# EAGLE design rf-sender-v1 (EAGLE 6.4)
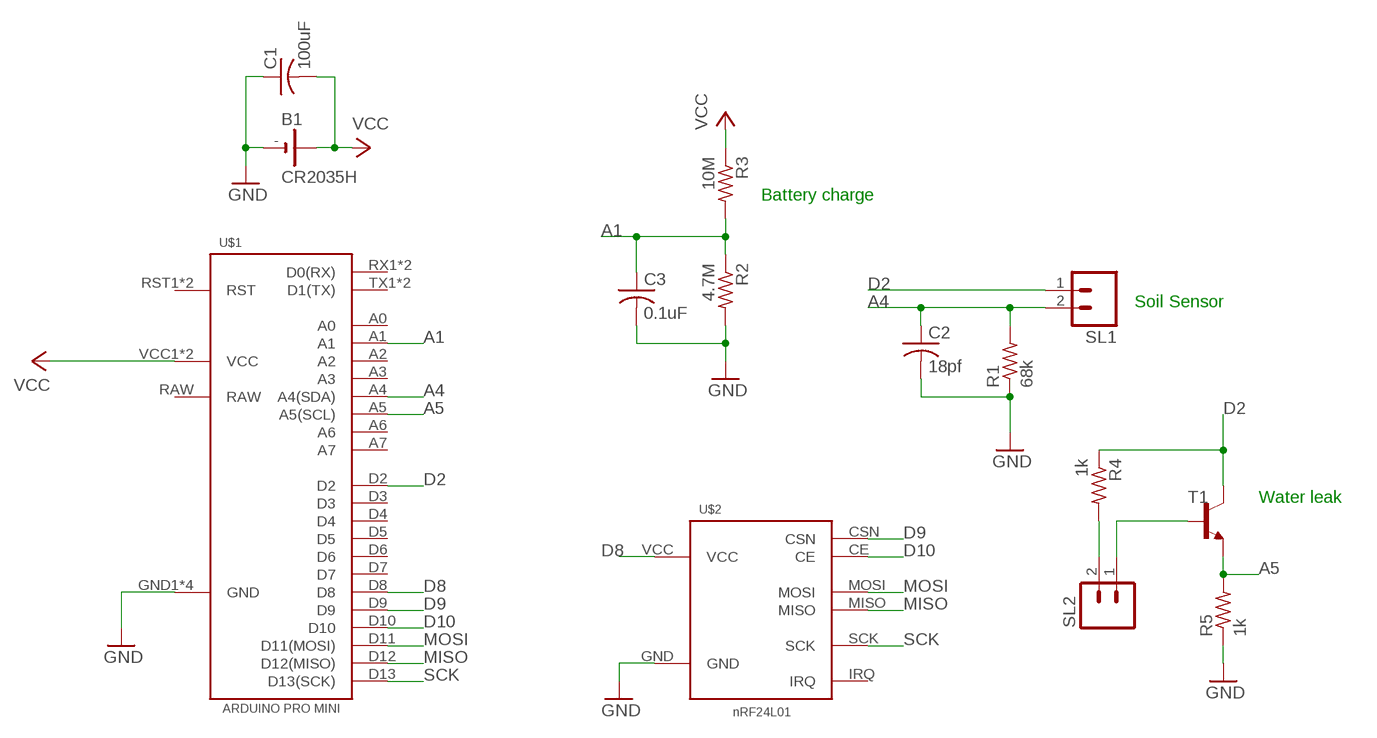
[diagram p0: schematic, sheet 1]

## Parts
B1  CR2035H  [CR2032H]
C1  100uF  C-USC2220K  [C2220K]
C2  18pf  C-USC0805  [C0805]
C3  0.1uF  C-USC0603  [C0603]
R1  68k  R-US_R0603  [R0603]
R2  4.7M  R-US_R0603  [R0603]
R3  10M  R-US_R0603  [R0603]
R4  1k  R-US_R0603  [R0603]
R5  1k  R-US_R0603  [R0603]
SL1  M02  [02P]
SL2  M02  [02P]
T1  BC808-NPN-SOT23-BEC  [SOT23-BEC]
U$1  ARDUINO-PRO-MINI  [ARDUINO-PRO-MINI]
U$2  NRF24L01MODULE  [NRF24L01-MODULE]

## Nets
A1: C3.1 R2.1 R3.2 U$1.A1
A4: C2.1 R1.2 SL1.2 U$1.A4(A4(SDA))
A5: R5.2 T1.E U$1.A5(A5(SCL))
D2: R4.1 SL1.1 T1.C U$1.D2
D8: U$1.D8 U$2.VCC
D9: U$1.D9 U$2.CSN
D10: U$1.D10 U$2.CE
GND: B1.- C1.1 C2.2 C3.2 R1.1 R2.2 R5.1 U$1.GND1(GND) U$1.GND2(GND) U$1.GND3(GND) U$1.GND4(GND) U$2.GND
MISO: U$1.D12(D12(MISO)) U$2.MISO
MOSI: U$1.D11(D11(MOSI)) U$2.MOSI
N$3: SL2.1 T1.B
N$4: R4.2 SL2.2
SCK: U$1.D13(D13(SCK)) U$2.SCK
VCC: B1.+ C1.2 R3.1 U$1.VCC1(VCC) U$1.VCC2(VCC)
Unconnected: U$1.A0 U$1.A2 U$1.A3 U$1.A6 U$1.A7 U$1.D3 U$1.D4 U$1.D5 U$1.D6 U$1.D7 U$1.RST1(RST) U$1.RST2(RST) U$1.RX1(D0(RX)) U$1.RX2(D0(RX)) U$1.TX1(D1(TX)) U$1.TX2(D1(TX)) U$2.IRQ

## Notes on the sheet
- Battery charge
- Soil Sensor
- Water leak

## Power pins joined to a net without a drawn wire
RAW: U$1.RAW

## Library data of the parts
B1 = serge:CR2035H
C1-C3 = adafruit:C-US: CAPACITOR, American symbol
R1-R5 = adafruit:R-US_: RESISTOR, American symbol
SL1 SL2 = con-amp-quick:M02: AMP QUICK CONNECTOR; OC_FARNELL: unknown; OC_NEWARK: unknown
T1 = transistor:*-NPN-: NPN Transistror BF959 corrected 2008.03.06
U$1 = serge:ARDUINO-PRO-MINI
U$2 = serge:NRF24L01

## Board
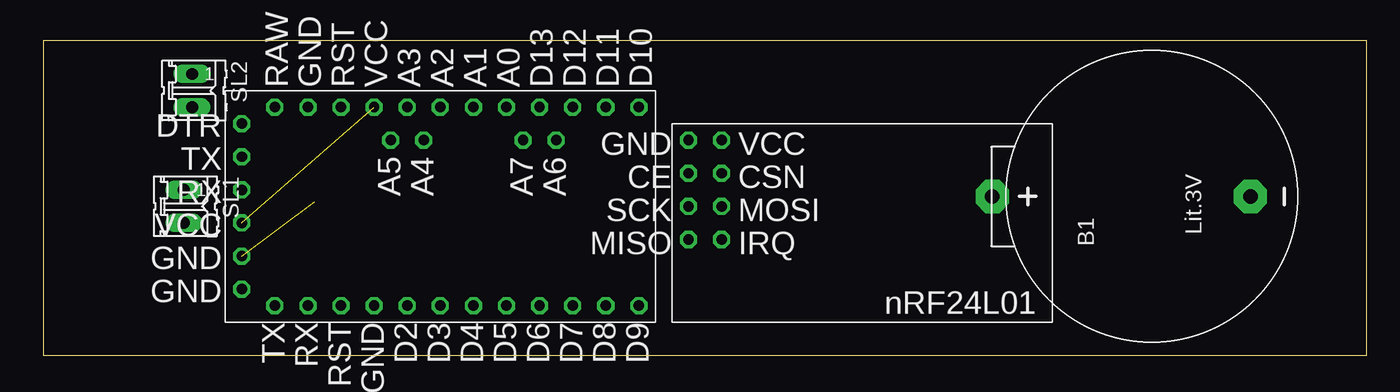
[diagram p1: board, top side]
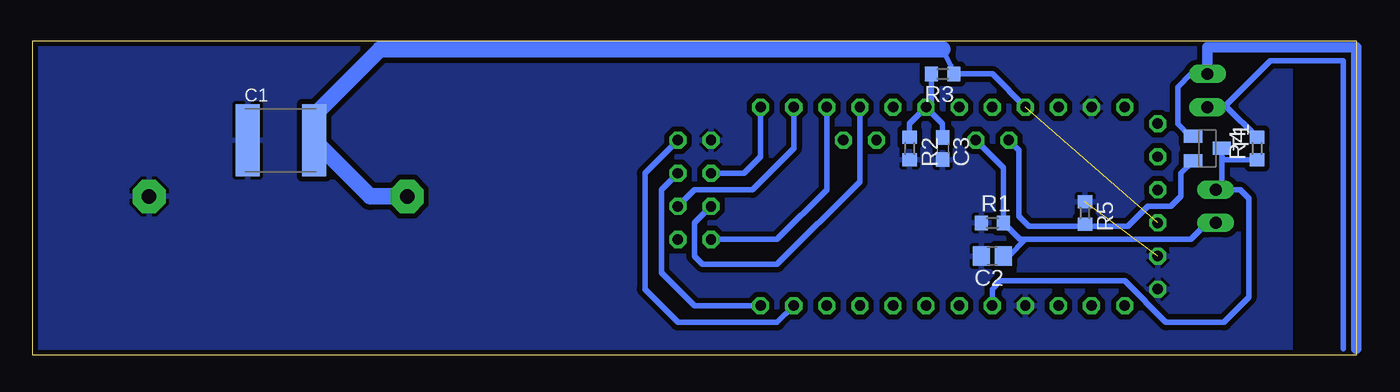
[diagram p2: board, bottom side, seen from below]

Size 101.6 x 24.13 mm. Coordinates in mm from the lower left corner, seen from the top.
Outline: 0,0 101.6,0 101.6,24.13 0,24.13 0,0
Copper layers (1*16): Top 0.035mm / dielectric 1.5mm / Bottom 0.035mm
Design rules "default": minimum track width 10mil, minimum drill 24mil, track to track 16mil, track to pad 16mil, pad to pad 16mil, via to via 16mil, smd to smd 16mil, copper to edge 16mil, drill to drill 8mil, minimum pad ring 10mil, minimum via ring 8mil, stop-mask expansion 4mil, vias tented up to drill 0mil, thermal gap 10mil

### Footprints (pad centres in the part's own frame; a part is rotated, then mirrored left to right if it is on the bottom)
CR2032H = drill 1.118 pad 2.54 octagon: + 0,10.973; - 0,-8.839
C2220K = smd 1.85 x 5.5: 1 -2.55,0; 2 2.55,0
C0805 = smd 1.3 x 1.5: 1 -0.85,0; 2 0.85,0
C0603 = smd 1.1 x 1: 1 -0.85,0; 2 0.85,0
R0603 = smd 1 x 1.1: 1 -0.85,0; 2 0.85,0
02P = drill 0.914 long: 1 -1.27,0; 2 1.27,0
SOT23-BEC = smd 1 x 1.4: B -0.95,-1.1; C 0,1.1; E 0.95,-1.1
ARDUINO-PRO-MINI = drill 0.8 octagon: A0 -3.81,-7.62; A1 -1.27,-7.62; A2 1.27,-7.62; A3 3.81,-7.62; A4 2.54,-5.08; A5 5.08,-5.08; A6 -7.62,-5.08; A7 -5.08,-5.08; D2 3.81,7.62; D3 1.27,7.62; D4 -1.27,7.62; D5 -3.81,7.62; D6 -6.35,7.62; D7 -8.89,7.62; D8 -11.43,7.62; D9 -13.97,7.62; D10 -13.97,-7.62; D11 -11.43,-7.62; D12 -8.89,-7.62; D13 -6.35,-7.62; DTR 16.51,-6.35; GND1 11.43,-7.62; GND2 16.51,6.35; GND3 16.51,3.81; GND4 6.35,7.62; RAW 13.97,-7.62; RST1 8.89,7.62; RST2 8.89,-7.62; RX1 11.43,7.62; RX2 16.51,-1.27; TX1 13.97,7.62; TX2 16.51,-3.81; VCC1 16.51,1.27; VCC2 6.35,-7.62
NRF24L01-MODULE = drill 0.8 octagon: CE 10.16,-2.54; CSN 7.62,-2.54; GND 10.16,-5.08; IRQ 7.62,2.54; MISO 10.16,2.54; MOSI 7.62,0; SCK 10.16,0; VCC 7.62,-5.08

### Placement (x,y rotation side)
B1  83.82,12.19 90 top
C1  82.55,16.51 0 bottom
C2  27.94,7.62 180 bottom
C3  31.75,15.88 270 bottom
R1  27.94,10.16 0 bottom
R2  34.29,15.88 270 bottom
R3  31.75,21.59 180 bottom
R4  7.62,15.88 90 bottom
R5  20.83,10.92 270 bottom
SL1  10.79,11.43 270 top
SL2  11.43,20.32 270 top
T1  11.43,15.88 270 bottom
U$1  31.75,11.43 180 top
U$2  59.69,11.43 180 top

### Tracks (layer width: path | path; a pad name or v marks a point on that pad's centre or on a via)
A1
  Bottom 0.406: R3.2 32.6,19.47 U$1.A1 | R2.1 34.29,17.78 U$1.A1 | C3.1 31.75,17.78 U$1.A1
A4
  Bottom 0.406: U$1.A4 27.09,14.39 R1.2 25.82,8.89 25.4,8.89 | SL1.2 11.43,10.16 12.7,8.89 25.4,8.89 | C2.1 26.67,7.62 25.4,8.89
A5
  Bottom 0.406: T1.E 12.53,14.9 13.46,13.97 13.46,12.19 14.22,11.43 16,11.43 17.53,9.91 20.41,9.91 R5.2 21.17,10.07 21.34,9.91 25.15,9.91 25.91,10.67 25.91,15.75 U$1.A5
D2
  Bottom 0.406: U$1.D2 27.94,5.08 27.3,5.71 17.78,5.71 14.61,2.54 10.16,2.54 8.26,4.45 8.26,12.06 8.89,12.7 SL1.1 10.33,13.16 10.33,15.24 | T1.C 10.33,15.24 | R4.1 10.12,15.03 10.33,15.24
D8
  Bottom 0.406: U$2.VCC 54.61,13.97 54.61,5.08 52.07,2.54 44.45,2.54 U$1.D8
D9
  Bottom 0.406: U$1.D9 50.8,3.81 53.34,6.35 53.34,12.7 U$2.CSN
D10
  Bottom 0.406: U$2.CE 46.99,13.97 45.72,15.24 U$1.D10
GND  (1 unrouted)
  pour Bottom: 5.08,0 5.08,24.13 101.6,24.13 101.6,0
MISO
  Bottom 0.406: U$1.D12 40.64,12.7 44.45,8.89 U$2.MISO
MOSI
  Bottom 0.406: U$2.MOSI 50.8,12.7 46.35,12.7 43.18,15.88 U$1.D11
N$3
  Bottom 0.406: T1.B 12.76,16.82 13.72,17.78 13.72,20.57 12.7,21.59 SL2.1
  Bottom 0.813: 0,0.51 0,23.62 11.43,23.62 SL2.1
N$4
  Bottom 0.406: 1.02,0.51 1.02,22.61 6.6,22.61 10.16,19.05 | SL2.2 10.16,19.05 | 10.16,19.05 9.95,19.05 R4.2
SCK
  Bottom 0.406: U$1.D13 38.1,13.34 44.45,6.99 50.16,6.99 50.8,7.62 50.8,10.16 U$2.SCK
VCC  (1 unrouted)
  Bottom 0.406: U$1.VCC2 27.94,21.59 R3.1 31.11,21.8 31.11,22.23 31.75,23.5 | 80,18.43 C1.2
  Bottom 1.27: 31.75,23.5 74.93,23.5 80,18.43 | B1.+ 75.68,12.19 C1.2